# EAGLE design Multimeter1.2 (EAGLE 7.1.0)
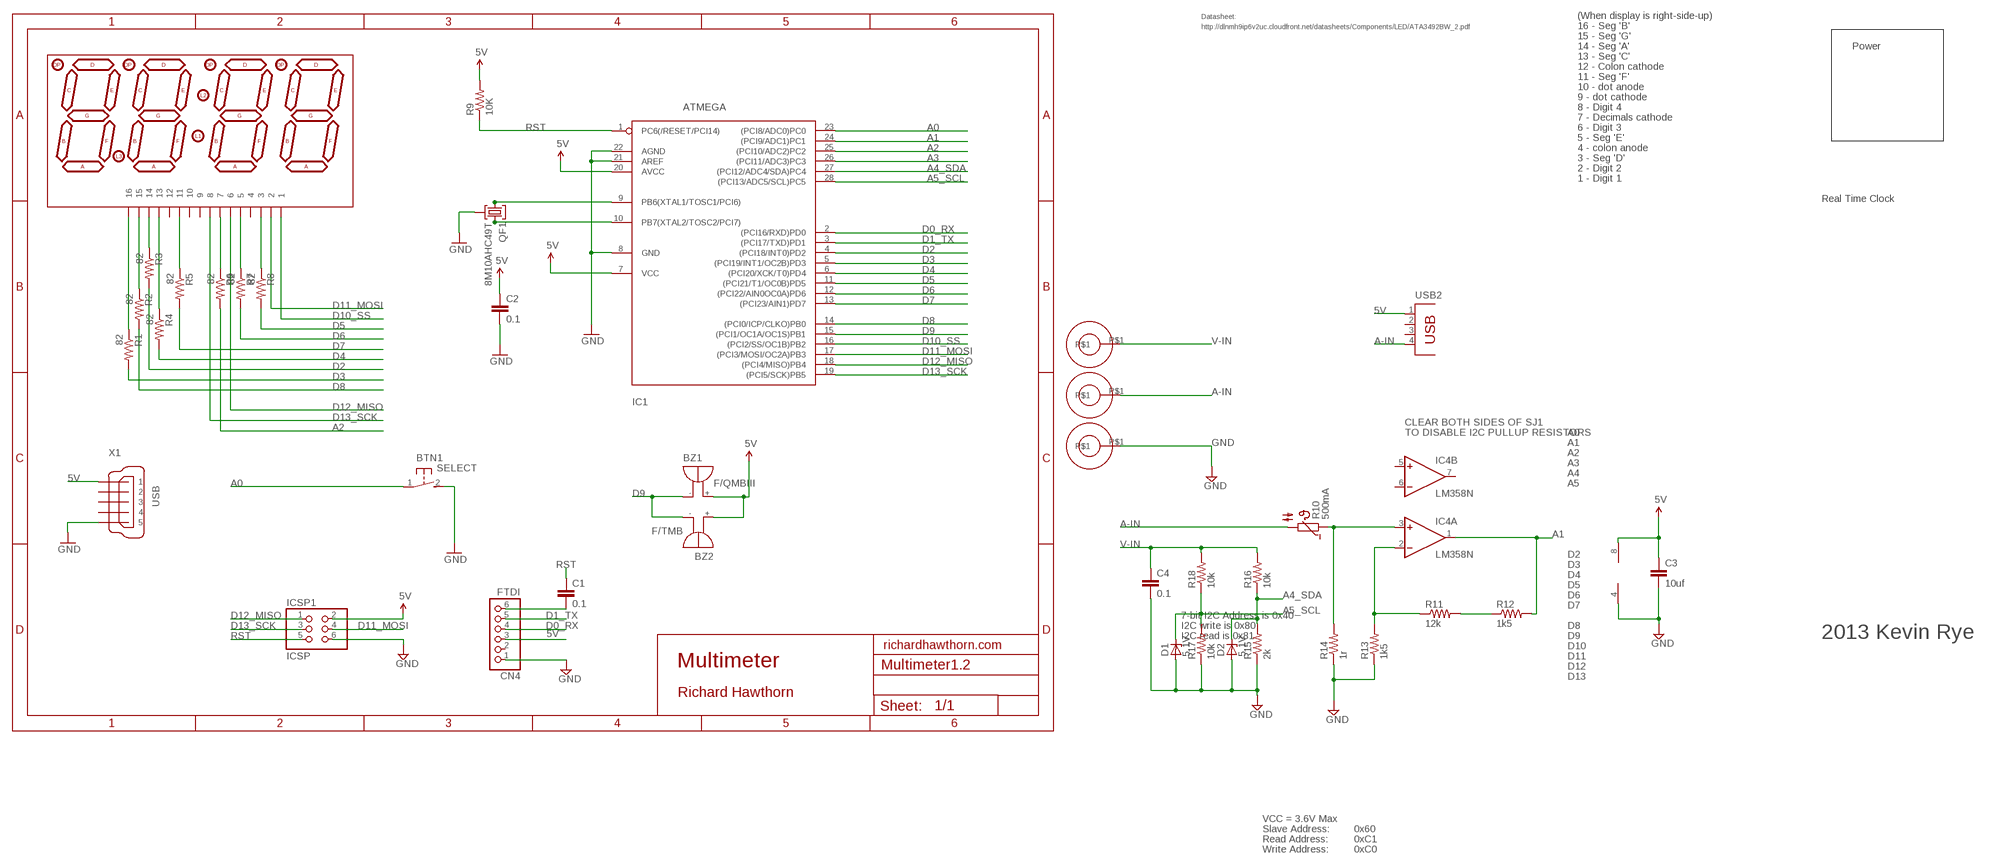
[diagram p0: schematic, sheet 1]

## Parts
BTN1  SELECT  DTS-3  [DTS-3]
BZ1  F/QMBIII  [F/QMBIII]
BZ2  F/TMB  [F/TMB]
C1  0.1  CAPPTH2  [CAP-PTH-SMALL2]
C2  0.1  CAPPTH2  [CAP-PTH-SMALL2]
C3  10uf  CAPPTH2  [CAP-PTH-SMALL2]
C4  0.1  CAPPTH2  [CAP-PTH-SMALL2]
CN4  FTDI  PINHD-1X6  [1X06]
D1  5.1V  BZX90  [DO34Z7]
D2  5.1V  BZX90  [DO34Z7]
IC1  ATMEGA  ATMEGA168PROUND  [DIL28-3-ROUND]
IC4  LM358N  [DIL08]
ICSP1  ICSP  PINHD-2X3  [2X03]
LED1  7SEG-4DIGIT  [SPARKFUN_7-SEGMENT-4DIGIT]
QF1  8M10AHC49T  [HC49U]
R1  82  R-US_0204/7  [0204/7]
R2  82  R-US_0204/7  [0204/7]
R3  82  R-US_0204/7  [0204/7]
R4  82  R-US_0204/7  [0204/7]
R5  82  R-US_0204/7  [0204/7]
R6  82  R-US_0204/7  [0204/7]
R7  82  R-US_0204/7  [0204/7]
R8  82  R-US_0204/7  [0204/7]
R9  10K  R-US_0204/7  [0204/7]
R10  500mA  B57164  [B57164]
R11  12k  R-US_0204/7  [0204/7]
R12  1k5  R-US_0204/7  [0204/7]
R13  1k5  R-US_0204/7  [0204/7]
R14  1r  R-US_0204/7  [0204/7]
R15  2k  R-US_0204/7  [0204/7]
R16  10k  R-US_0204/7  [0204/7]
R17  10k  R-US_0204/7  [0204/7]
R18  10k  R-US_0204/7  [0204/7]
U$1  BANANA  [BANANA]
U$5  BANANA  [BANANA]
U$6  BANANA  [BANANA]
USB2  PN87520  [PN87520]
X1  USB  MINI-USB_SHIELD5P2-32005-601  [32005-601]

## Nets
5V [power]: BZ1.+(-) BZ2.+ C2.1 C3.1 CN4.3 IC1.7(VCC) IC1.20(AVCC) IC4.8(P:V+) ICSP1.2 R9.2 USB2.1 X1.1
A0: BTN1.1 IC1.23((PCI8/ADC0)PC0)
A1: IC1.24((PCI9/ADC1)PC1) IC4.1(A:OUT) R12.2
A2: IC1.25((PCI10/ADC2)PC2) R6.2
A3: IC1.26((PCI11/ADC3)PC3)
A4_SDA: D2.C IC1.27((PCI12/ADC4/SDA)PC4) R15.2 R16.1
A5_SCL [power]: D1.C IC1.28((PCI13/ADC5/SCL)PC5) R17.2 R18.1
A-IN [power]: R10.2 U$5.P$1 USB2.4
D0_RX: CN4.4 IC1.2((PCI16/RXD)PD0)
D1_TX: CN4.5 IC1.3((PCI17/TXD)PD1)
D2: IC1.4((PCI18/INT0)PD2) R3.2
D3: IC1.5((PCI19/INT1/OC2B)PD3) R1.2
D4: IC1.6((PCI20/XCK/T0)PD4) R4.2
D5: IC1.11((PCI21/T1/OC0B)PD5) R8.2
D6: IC1.12((PCI22/AIN0OC0A)PD6) R7.2
D7: IC1.13((PCI23/AIN1)PD7) R5.2
D8: IC1.14((PCI0/ICP/CLKO)PB0) R2.2
D9: BZ1.-(+) BZ2.- IC1.15((PCI1/OC1A/OC1S)PB1)
D10_SS: IC1.16((PCI2/SS/OC1B)PB2) LED1.1
D11_MOSI: IC1.17((PCI3/MOSI/OC2A)PB3) ICSP1.4 LED1.2
D12_MISO: IC1.18((PCI4/MISO)PB4) ICSP1.1 LED1.6
D13_SCK: IC1.19((PCI5/SCK)PB5) ICSP1.3 LED1.8
GND [power]: BTN1.2 C2.2 C3.2 C4.2 CN4.1 D1.A D2.A IC1.8(GND) IC1.21(AREF) IC1.22(AGND) IC4.4(P:V-) ICSP1.6 QF1.2 R13.1 R14.1 R15.1 R17.1 U$6.P$1 X1.5
N$3: LED1.16 R1.1
N$4: IC4.2(A:-IN) R11.1 R13.2
N$5: LED1.15 R2.1
N$10: R11.2 R12.1
N$12: LED1.7 R6.1
N$13 [power]: IC4.3(A:+IN) R10.1 R14.2
N$16: IC1.9(PB6(XTAL1/TOSC1/PCI6)) QF1.1
N$20: C1.2 CN4.6
N$22: LED1.13 R4.1
N$24: LED1.14 R3.1
N$25: LED1.11 R5.1
N$26: IC1.10(PB7(XTAL2/TOSC2/PCI7)) QF1.3
N$29: LED1.5 R7.1
N$30: LED1.3 R8.1
RST: C1.1 IC1.1(PC6(/RESET/PCI14)) ICSP1.5 R9.1
V-IN [power]: C4.1 R16.2 R18.2 U$1.P$1
Unconnected: CN4.2 IC4.5(B:+IN) IC4.6(B:-IN) IC4.7(B:OUT) LED1.4 LED1.9 LED1.10 LED1.12 USB2.2 USB2.3 X1.2 X1.3 X1.4 X1.M1(S1) X1.M2(S2)

## Notes on the sheet
- Datasheet: | (When display is right-side-up)
- http://dlnmh9ip6v2uc.cloudfront.net/datasheets/Components/LED/ATA3492BW_2.pdf | 16 - Seg 'B'
- 15 - Seg 'G'
- 14 - Seg 'A' | Power
- 13 - Seg 'C'
- 12 - Colon cathode
- 11 - Seg 'F'
- 10 - dot anode
- 9 - dot cathode
- 8 - Digit 4
- 7 - Decimals cathode
- 6 - Digit 3
- 5 - Seg 'E'
- 4 - colon anode
- 3 - Seg 'D'
- 2 - Digit 2
- 1 - Digit 1
- Real Time Clock
- CLEAR BOTH SIDES OF SJ1
- TO DISABLE I2C PULLUP RESISTORS | A0
- A1
- A2
- A3
- A4
- A5
- D2
- D3
- D4
- D5
- D6
- D7
- 7-bit I2C Address is 0x40
- I2C write is 0x80 | D8
- I2C read is 0x81 | D9 | 2013 Kevin Rye
- richardhawthorn.com | D10
- D11
- Multimeter | D12
- D13
- Richard Hawthorn
- VCC = 3.6V Max
- Slave Address: | 0x60
- Read Address: | 0xC1
- Write Address: | 0xC0

## Library data of the parts
BTN1 = switch-tact:DTS-3
BZ1 = buzzer:F/QMBIII: BUZZER Source: Buerklin; OC_FARNELL: unknown; OC_NEWARK: unknown
BZ2 = buzzer:F/TMB: BUZZER Source: Buerklin; OC_FARNELL: unknown; OC_NEWARK: unknown
C1-C4 = LowPowerLab:CAP: Capacitor Standard 0603 ceramic capacitor, and 0.1" leaded capacitor.
CN4 = pinhead:PINHD-1X6: PIN HEADER
D1 D2 = diode:BZX90: Z DIODE
IC1 = adafruit:ATMEGA168*P: MICROCONTROLLER 16 kBytes FLASH 1 kBytes SRAM 512 Bytes EEPROM USART 8-channel 10 bit ADC
IC4 = linear:LM358: OP AMP also LM158; LM258; LM2904 Source: http://cache.national.com/ds/LM/LM158.pdf
ICSP1 = pinhead:PINHD-2X3: PIN HEADER
LED1 = sparkfun-4digit-sseg:7SEG-4DIGIT
QF1 = crystal:8M10AHC49T: Monolithic Crystal Filters Source: www.vanlong.com; OC_FARNELL: unknown; OC_NEWARK: unknown
R1-R9 R11-R18 = adafruit:R-US_: RESISTOR, American symbol
R10 = ptc-ntc:B57164: SIEMENS NTC; MPN: B57164K474K52; OC_FARNELL: 9753451; OC_NEWARK: 29M3118
U$1 U$5 U$6 = Richards:BANANA
USB2 = con-berg:PN87520: BERG USB connector; OC_FARNELL: unknown; OC_NEWARK: unknown
X1 = con-cypressindustries:MINI-USB_SHIELD5P2-: MINI USB-B R/A DIP 5pol. Source: www.cypressindustries.com; OC_FARNELL: unknown; OC_NEWARK: unknown

## Net classes
1 power: width 0.635 mm, clearance 0.254 mm

## Board
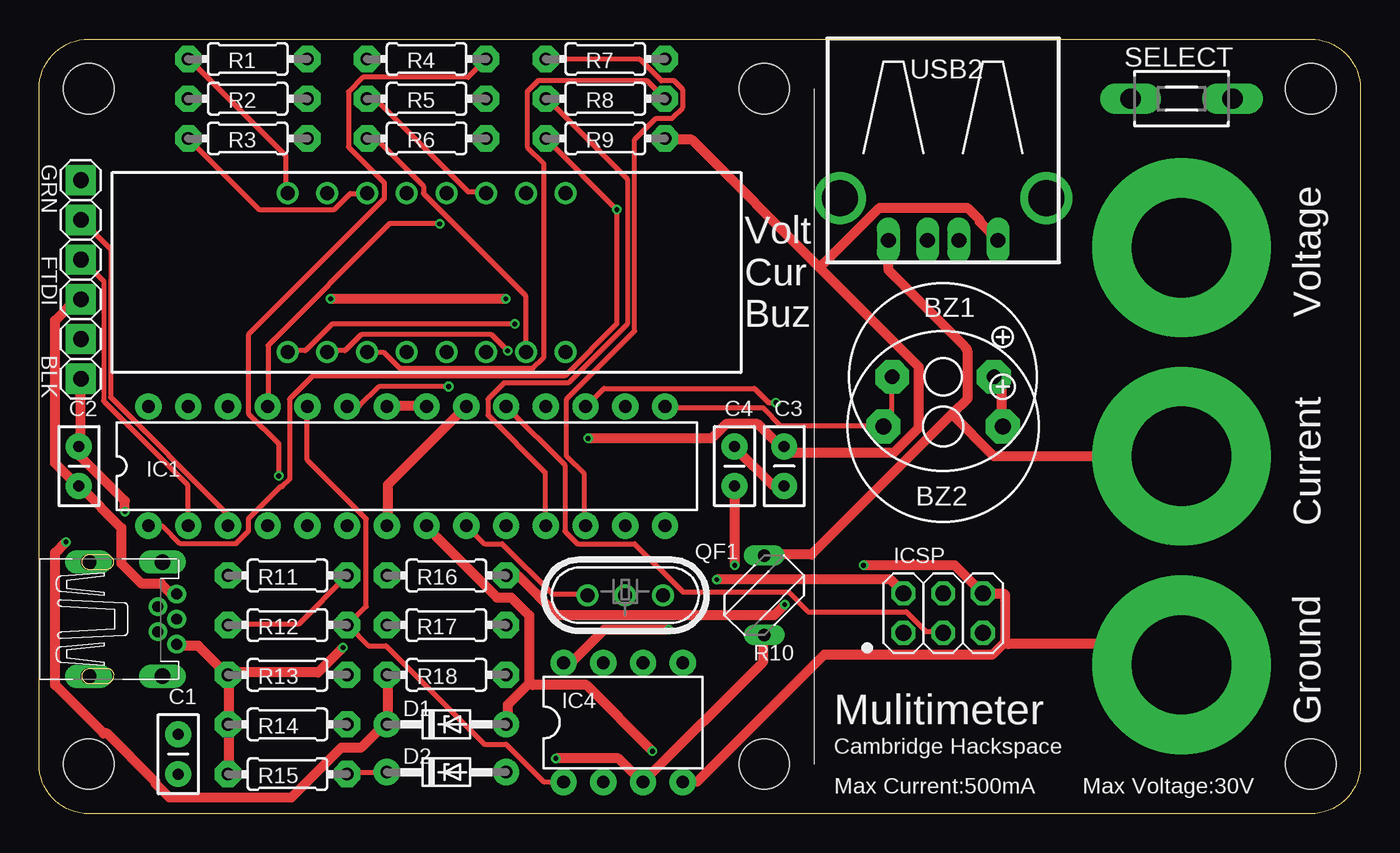
[diagram p1: board, top side]
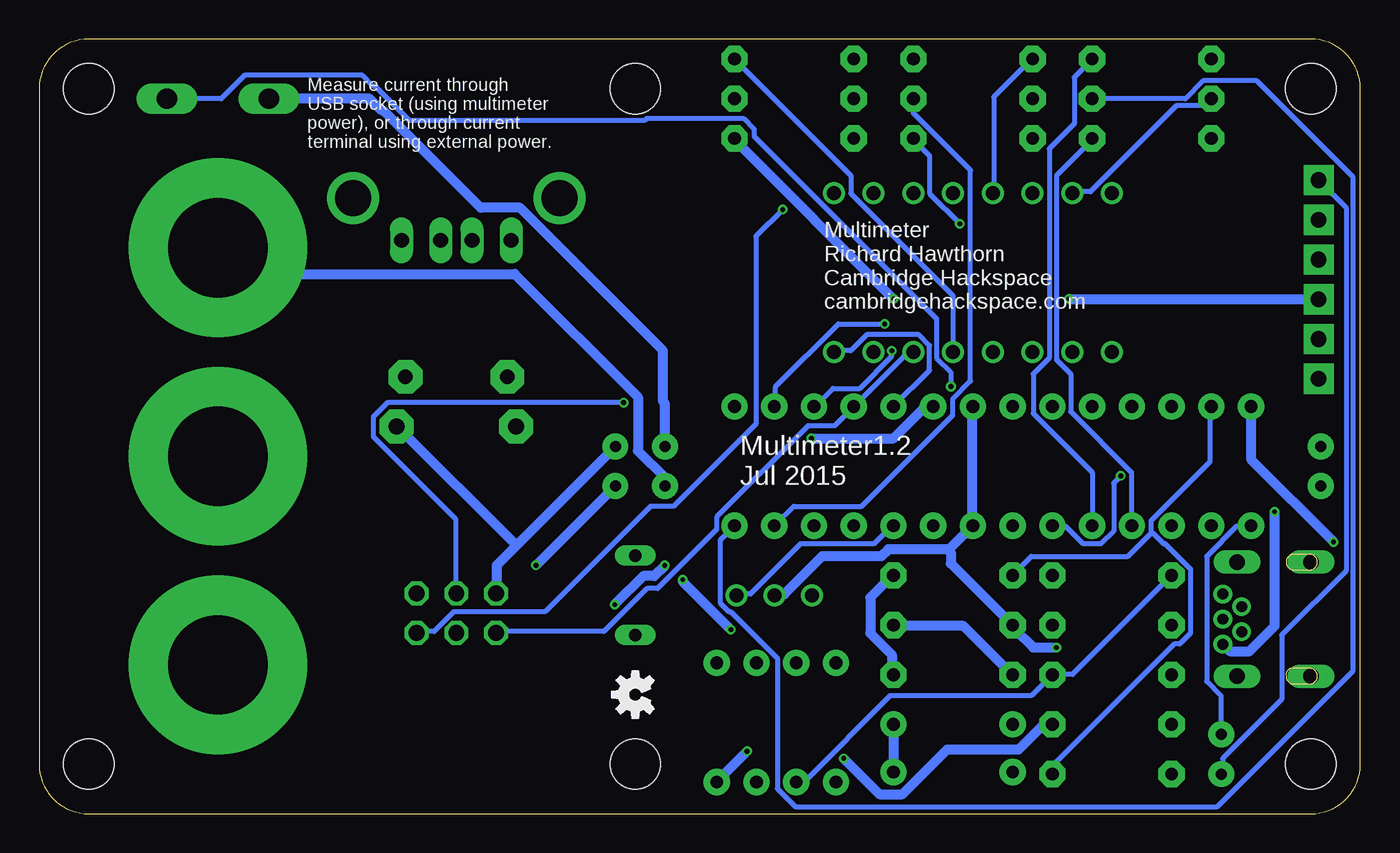
[diagram p2: board, bottom side, seen from below]

Size 84.45 x 49.53 mm. Coordinates in mm from the lower left corner, seen from the top.
Outline: 46.35,49.53 3.17,49.53 arc90 0,46.35 0,3.17 arc90 3.17,0 46.35,0
Outline: 34.29,49.53 81.28,49.53 arc-90 84.45,46.35 84.45,3.17 arc-90 81.28,0 27.94,0
Copper layers (1*16): Top 0.035mm / dielectric 1.5mm / Bottom 0.035mm
Design rules "ITEADstudio_DRC *": minimum track width 12mil, minimum drill 12mil, track to track 6mil, track to pad 6mil, pad to pad 6mil, via to via 6mil, smd to smd 0mil, copper to edge 10mil, drill to drill 10mil, minimum pad ring 10mil, minimum via ring 6mil, stop-mask expansion 2mil, vias tented up to drill 100mil, thermal gap 15mil
Holes 3.2 mm at 3.17,3.17 46.35,3.17 3.17,46.35 46.35,46.35 81.28,46.35 81.28,3.17
tKeepout: area 0,0 to 5.7,5.7; area 0,43.8 to 5.7,49.5; area 78.7,43.8 to 84.5,49.5; area 78.7,0 to 84.5,5.7
bKeepout: area 0,43.8 to 5.7,49.5; area 0,0 to 5.7,5.7; area 78.7,43.8 to 84.5,49.5; area 78.7,0 to 84.5,5.7
tRestrict: area 24.3,8.9 to 29.1,12.8; area 5.8,16.9 to 6.9,18.5; area 5.2,9.7 to 6.7,10.4
bRestrict: area 27.4,17.7 to 29.2,18.7; area 21.1,13.8 to 22.9,14.9; area 21.6,12.6 to 22.1,13.2; area 20.7,12.6 to 21.2,13.2; area 20.2,12.8 to 20.7,13.5; area 20.1,13.4 to 20.6,14; area 26.5,18.9 to 27.1,19.5; area 26.5,17.9 to 27.1,18.5; area 27.5,19.1 to 28,19.8; area 27.9,18.8 to 29.1,19.6

### Footprints (pad centres in the part's own frame; a part is rotated, then mirrored left to right if it is on the bottom)
DTS-3 = drill 1.3 long: 1 -3.25,0; 2 3.25,0
F/QMBIII = drill 0.914 pad 2.159 octagon: + 3.251,0; - -3.251,0
F/TMB = drill 1.016 pad 2.159 octagon: + 3.81,0; - -3.81,0
CAP-PTH-SMALL2 = drill 0.7 pad 1.651: 1 0,0; 2 2.54,0
1X06 = drill 1 pad 1.93 square: 1 -6.35,0; 2 -3.81,0; 3 -1.27,0; 4 1.27,0; 5 3.81,0; 6 6.35,0
DO34Z7 = drill 0.813 pad 1.676: A 3.81,0; C -3.81,0
DIL28-3-ROUND = drill 0.813 pad 1.676: 1 -16.51,-3.81; 2 -13.97,-3.81; 3 -11.43,-3.81; 4 -8.89,-3.81; 5 -6.35,-3.81; 6 -3.81,-3.81; 7 -1.27,-3.81; 8 1.27,-3.81; 9 3.81,-3.81; 10 6.35,-3.81; 11 8.89,-3.81; 12 11.43,-3.81; 13 13.97,-3.81; 14 16.51,-3.81; 15 16.51,3.81; 16 13.97,3.81; 17 11.43,3.81; 18 8.89,3.81; 19 6.35,3.81; 20 3.81,3.81; 21 1.27,3.81; 22 -1.27,3.81; 23 -3.81,3.81; 24 -6.35,3.81; 25 -8.89,3.81; 26 -11.43,3.81; 27 -13.97,3.81; 28 -16.51,3.81
DIL08 = drill 0.813 pad 1.676: 1 -3.81,-3.81; 2 -1.27,-3.81; 3 1.27,-3.81; 4 3.81,-3.81; 5 3.81,3.81; 6 1.27,3.81; 7 -1.27,3.81; 8 -3.81,3.81
2X03 = drill 1.016 octagon: 1 -2.54,-1.27; 2 -2.54,1.27; 3 0,-1.27; 4 0,1.27; 5 2.54,-1.27; 6 2.54,1.27
SPARKFUN_7-SEGMENT-4DIGIT = drill 0.9: 1 -8.89,-5.08; 2 -6.35,-5.08; 3 -3.81,-5.08; 4 -1.27,-5.08; 5 1.27,-5.08; 6 3.81,-5.08; 7 6.35,-5.08; 8 8.89,-5.08; 9 8.89,5.08; 10 6.35,5.08; 11 3.81,5.08; 12 1.27,5.08; 13 -1.27,5.08; 14 -3.81,5.08; 15 -6.35,5.08; 16 -8.89,5.08
HC49U = drill 0.9: 1 -2.413,0; 2 -0.027,0; 3 2.413,0
0204/7 = drill 0.813 pad 1.676 octagon: 1 -3.81,0; 2 3.81,0
B57164 = drill 0.813 long: 1 -2.54,0; 2 2.54,0
BANANA = drill 6.35 pad 11.43: P$1 0,0
PN87520 = drill 0.95 long: 1 -3.5,2.71; 2 -1,2.71; 3 1,2.71; 4 3.5,2.71 | drill 2.3: P$1 -6.604,0; P$2 6.604,0
32005-601 = drill 0.7 pad 1.016: 1 2.825,1.6; 2 1.625,0.8; 3 2.825,0; 4 1.625,-0.8; 5 2.825,-1.6 | drill 1 pad 1.422 long: M1 -2.825,3.65; M2 -2.825,-3.65; M3 1.925,3.65; M4 1.925,-3.65

### Placement (x,y rotation side)
BTN1  73.03,45.72 180 top
BZ1  57.78,27.94 0 top
BZ2  57.78,24.77 0 top
C1  8.89,5.08 270 top
C2  2.54,20.95 90 top
C3  47.62,23.5 270 top
C4  44.45,20.95 90 top
CN4  2.67,34.16 90 top
D1  26.04,5.71 0 top
D2  26.04,2.67 0 top
IC1  23.5,22.23 0 top
IC4  37.34,5.84 0 top
ICSP1  57.78,12.83 0 top
LED1  24.77,34.61 0 top
QF1  37.47,13.97 0 top
R1  13.34,48.26 0 top
R2  13.34,45.72 0 top
R3  13.34,43.18 0 top
R4  24.77,48.26 0 top
R5  24.77,45.72 0 top
R6  24.77,43.18 0 top
R7  36.2,48.26 180 top
R8  36.2,45.72 180 top
R9  36.2,43.18 0 top
R10  46.35,13.97 90 top
R11  15.88,15.24 0 top
R12  15.88,12.06 0 top
R13  15.88,8.89 0 top
R14  15.88,5.71 0 top
R15  15.88,2.54 0 top
R16  26.04,15.24 0 top
R17  26.04,12.06 0 top
R18  26.04,8.89 0 top
U$1  73.03,36.2 0 top
U$3  [OSHW-LOGO-S]  46.35,7.62 90 bottom
U$5  73.03,22.86 0 top
U$6  73.03,9.53 0 top
USB2  57.78,39.37 180 top
X1  5.97,12.45 0 top

### Tracks (layer width: path | path; a pad name or v marks a point on that pad's centre or on a via)
5V  (via drill 0.3)
  Top 0.635: X1.1 8.69,14.06 8.46,14.06 7.77,14.74 6.51,14.74 5.26,16 5.26,18.29 2.63,20.92 C2.1 2.29,21.14 1.03,22.4 1.03,31.55 2.29,32.8 2.63,32.8 CN4.3 | IC1.7 22.29,18.52 22.29,21.03 27.2,25.95 IC1.20 | BZ2.+ 61.49,24.8 61.49,27.43 61.04,27.89 BZ1.+ | v40.23,11.77 36.12,11.77 34.06,9.72 33.6,9.72 IC4.8 | v43.32,14.97 54.41,14.97 55.21,14.17 ICSP1.2 | 49.89,34.92 56.24,28.57 56.24,24.69 54.63,23.09 48.01,23.09 47.66,23.43 C3.1 47.32,23.55 45.95,24.92 43.89,24.92 42.98,24 v35.09,24 | 49.89,34.92 41.72,43.09 40.01,43.09 R9.2 | v29.83,32.92 v18.63,32.92 | 49.89,34.92 53.72,38.75 59.32,38.75 60.12,37.95 60.12,37.83 61.27,36.69 USB2.1
  Bottom 0.635: 53.95,17.14 47.66,23.43 C3.1 | 53.95,17.14 55.21,15.89 55.21,14.17 ICSP1.2 | v40.23,11.77 43.32,14.86 v43.32,14.97 | 53.95,17.14 61.49,24.69 BZ2.+ | v35.09,24 29.83,24 27.89,25.95 27.32,25.95 IC1.20 | v18.63,32.92 2.74,32.92 CN4.3 | v29.83,32.92 40.01,43.09 R9.2
A0  (via drill 0.3)
  Top 0.305: v26.18,27.32 21.72,27.32 20.46,26.06 19.77,26.06 IC1.23
  Bottom 0.305: v26.18,27.32 26.18,28.23 27.09,29.15 27.09,31.66 38.75,43.32 38.75,43.78 39.43,44.46 45.61,44.46 45.72,44.35 60.81,44.35 62.98,46.52 63.09,46.52 63.78,47.21 71.32,47.21 72.81,45.72 BTN1.1 76.24,45.15
A1
  Top 0.305: IC4.1 33.49,2.06 32.23,2.06 29.83,4.46 28.46,4.46 22.17,10.74 21.03,10.74 19.77,12 R12.2 19.77,12.12 20.92,13.26 20.92,18.86 17.14,22.63 IC1.24
A2  (via drill 0.3)
  Top 0.305: v25.6,37.72 22.4,37.72 14.63,29.95 14.63,26.06 IC1.25
  Bottom 0.305: v25.6,37.72 27.55,39.66 27.55,42.06 28.57,43.09 R6.2
A4_SDA
  Top 0.305: R15.2 19.77,2.63 22.17,2.63 D2.C
  Bottom 0.305: 13.37,17.95 13.37,18.75 9.6,22.52 9.6,25.95 IC1.27 | 13.37,17.95 14.86,16.46 21.03,16.46 22.17,15.32 R16.1 | R15.2 19.66,2.63 19.66,3.09 11.89,10.86 11.54,10.86 10.86,11.54 10.86,15.66 12.46,17.26 12.57,17.26 13.26,17.95 13.37,17.95
A5_SCL  (via drill 0.3)
  Top 0.635: R18.1 22.29,8.8 22.29,5.71 D1.C 21.95,5.6 20.57,4.23 19.32,4.23 16.12,1.03 8.34,1.03 7.43,1.94 7.43,2.06 4.34,5.14 4.12,5.14 1.03,8.23 1.03,16.69 v1.71,17.37
  Bottom 0.635: v1.71,17.37 6.97,22.63 6.97,25.95 IC1.28 | R17.2 29.83,12 25.38,12 22.29,8.91 R18.1
A-IN
  Top 0.635: 58.35,25.55 59.32,26.52 59.32,29.6 59.21,29.83 54.29,34.75 54.29,36.58 USB2.4 | 58.35,25.55 49.38,16.57 46.41,16.57 R10.2 | 58.35,25.55 61.04,22.86 U$5.P$1
D0_RX
  Top 0.305: IC1.2 9.49,18.52 9.49,21.03 4.12,26.4 4.12,34.06 2.74,35.43 CN4.4
D1_TX
  Top 0.305: IC1.3 12,18.52 12,19.2 4.57,26.63 4.57,36.12 2.74,37.95 CN4.5
D2
  Bottom 0.305: IC1.4 14.63,18.52 14.63,21.83 18.52,25.72 18.52,28.12 19.43,29.03 19.43,40.8 17.14,43.09 R3.2
D3
  Bottom 0.305: IC1.5 17.14,21.83 20.92,25.6 20.92,28.12 19.89,29.15 19.89,42.52 18.29,44.12 18.29,47.09 17.14,48.23 R1.2
D4  (via drill 0.3)
  Top 0.305: v15.32,21.6 15.32,23.66 13.37,25.6 13.37,30.63 22.06,39.32 22.06,40.35 19.77,42.63 19.77,46.18 20.69,47.09 27.43,47.09 28.57,48.23 R4.2
  Bottom 0.305: v15.32,21.6 15.77,21.14 15.77,18.06 16.57,17.26 17.72,17.26 18.86,18.4 19.66,18.4 IC1.6
D5
  Top 0.305: IC1.11 32.35,18.52 32.35,21.83 28.69,25.49 28.69,26.52 29.72,27.55 33.83,27.55 37.6,31.32 37.6,40.58 32.46,45.72 R8.2
D6
  Top 0.305: R7.2 32.46,48.23 38.41,48.23 39.78,46.86 40.58,46.86 41.15,46.29 41.15,45.15 40.46,44.46 39.43,44.46 38.06,43.09 38.06,30.86 33.72,26.52 33.72,22.86 34.86,21.72 34.86,18.52 IC1.12
D7
  Bottom 0.305: R5.2 28.57,44.81 24.92,41.15 24.92,27.66 26.06,26.52 26.06,25.49 31.89,19.66 36.23,19.66 37.38,18.52 IC1.13
D8
  Bottom 0.305: R2.2 11.2,45.72 10.06,46.86 6.63,46.86 0.46,40.69 0.46,9.14 9.14,0.46 36.12,0.46 37.26,1.6 37.26,9.94 40.23,12.92 40.35,12.92 40.92,13.49 40.92,17.49 40.01,18.4 IC1.14
D9
  Top 0.305: IC1.15 40.01,25.95 46.29,25.95 47.43,24.8 53.95,24.8 BZ2.- 53.95,24.92 54.52,25.49 54.52,27.89 BZ1.-
D10_SS  (via drill 0.3)
  Top 0.305: v30.4,31.32 18.75,31.32 17.03,29.6 15.89,29.6 LED1.1
  Bottom 0.305: v30.4,31.32 33.38,31.32 37.38,27.32 37.38,26.06 IC1.16
D11_MOSI  (via drill 0.3)
  Top 0.305: v29.95,29.6 28.92,30.63 20.57,30.63 19.55,29.6 18.52,29.6 LED1.2 | v47.09,26.29 46.63,26.29 45.72,27.2 36.12,27.2 34.98,26.06 IC1.17
  Bottom 0.305: v29.95,29.6 29.95,29.26 32,27.2 33.72,27.2 34.86,26.06 IC1.17 | v47.09,26.29 62.18,26.29 63.09,25.38 63.09,24.12 57.84,18.86 57.84,14.17 ICSP1.4
D12_MISO
  Bottom 0.305: LED1.6 28.57,29.49 28.92,29.49 32.35,26.06 IC1.18 32.46,25.95 33.6,24.8 35.32,24.8 41.15,18.97 41.15,18.17 44.92,14.4 45.61,14.4 48.35,11.66 55.21,11.66 ICSP1.1
D13_SCK
  Top 0.305: ICSP1.3 57.72,11.66 56.69,11.66 55.44,12.92 49.15,12.92 47.89,14.17 41.15,14.17 38.06,17.26 34.4,17.26 33.6,18.06 33.6,22.29 29.95,25.95 IC1.19
  Bottom 0.305: LED1.8 33.6,29.6 32.58,29.6 31.55,30.63 28.23,30.63 27.55,29.95 27.55,28.35 29.83,26.06 IC1.19
GND  (via drill 0.3)
  Top 0.635: CN4.1 2.63,27.77 2.63,23.55 C2.2 2.63,23.2 2.63,22.86 5.49,20 v5.49,19.32 | R15.1 12.12,2.63 12.12,5.71 R14.1 12.12,5.94 12.12,8.57 R13.1 | X1.5 8.8,10.74 10.17,10.74 12,8.91 R13.1 | IC1.22 22.29,26.06 24.69,26.06 IC1.21 | 31.32,8.34 29.95,6.97 29.95,5.71 D1.A | 31.32,8.34 31.32,12.69 30.18,13.83 29.26,13.83 24.69,18.4 IC1.8 | v19.43,10.63 17.83,9.03 12.34,9.03 R13.1 | C3.2 47.55,21.03 46.86,21.03 44.46,23.43 C4.2 | 61.72,10.97 60.92,10.17 50.18,10.17 42.06,2.06 41.15,2.06 IC4.4 | 61.72,10.97 61.72,14.06 60.35,14.06 ICSP1.6 60.12,14.29 58.52,15.89 v52.69,15.89 | v39.2,4 34.98,8.23 31.55,8.23 31.32,8.34 | 61.72,10.97 61.95,10.86 71.67,10.86 72.92,9.6 U$6.P$1
  Bottom 0.635: v5.49,19.32 5.49,12 7.09,10.4 8.34,10.4 8.69,10.74 X1.5 | D2.A 29.83,2.74 D1.A | 26.29,16.92 30.18,16.92 30.63,16.46 34.4,16.46 36.8,14.06 37.38,14.06 QF1.2 | 26.29,16.92 24.8,18.4 IC1.8 24.8,18.63 24.8,25.95 IC1.21 | 26.29,16.92 26.18,16.69 26.18,16 22.29,12.12 R17.1 22.06,11.77 20.92,10.63 v19.43,10.63 | C4.2 44.46,23.55 44.46,26.18 44.58,26.4 44.58,29.6 53.72,38.75 56.24,38.75 62.41,44.92 62.64,45.03 63.32,45.72 BTN1.2 | v52.69,15.89 C3.2 | v39.2,4 41.15,2.06 IC4.4
N$3
  Top 0.305: LED1.16 15.77,39.78 15.77,42.06 9.6,48.23 R1.1
N$4
  Bottom 0.305: R11.1 12.12,15.2 18.4,8.91 19.66,8.91 R13.2 21.03,7.54 30.06,7.54 35.55,2.06 36.01,2.06 IC4.2
N$5
  Bottom 0.305: LED1.15 18.4,39.78 17.26,39.78 11.77,45.26 10.06,45.26 9.6,45.72 R2.1
N$10
  Top 0.305: R12.1 12.12,12.12 16.57,12.12 19.66,15.2 R11.2
N$12
  Top 0.305: LED1.7 31.09,29.6 31.09,33.15 24.57,39.66 24.57,40.12 21.6,43.09 21.03,43.09 R6.1
N$13  (via drill 0.3)
  Top 0.635: R10.1 46.29,11.43 46.29,9.72 IC4.3 38.41,2.17 37.03,3.54 v33.03,3.54
  Bottom 0.635: R14.2 20.23,5.71 21.83,4.12 26.4,4.12 29.26,1.26 30.75,1.26 v33.03,3.54
N$16
  Top 0.305: IC1.9 28.46,17.26 29.6,17.26 32.8,14.06 34.98,14.06 QF1.1
N$20
  Bottom 0.305: C1.2 8.8,2.63 8.8,3.54 5.03,7.32 5.03,11.43 0.91,15.54 0.91,38.75 2.63,40.46 CN4.6
N$22
  Bottom 0.305: LED1.13 23.43,39.78 23.43,45.83 21.03,48.23 R4.1
N$24
  Top 0.305: LED1.14 20.92,39.66 19.89,39.66 18.86,38.63 14.06,38.63 9.6,43.09 R3.1
N$25
  Top 0.305: R5.1 21.49,45.72 27.43,39.78 28.57,39.78 LED1.11
N$26
  Bottom 0.305: QF1.3 39.78,14.06 38.98,14.06 35.78,17.26 31.09,17.26 29.95,18.4 IC1.10
N$29
  Bottom 0.305: LED1.5 26.06,29.6 26.06,33.15 32.58,39.66 32.58,40.8 40.01,48.23 R7.1
N$30
  Top 0.305: R8.1 38.86,46.86 31.89,46.86 31.2,46.18 31.2,42.63 32.23,41.6 32.23,29.15 31.55,28.46 23.09,28.46 22.06,29.49 21.03,29.49 LED1.3
RST  (via drill 0.3)
  Top 0.305: R9.1 32.46,43.09 v36.92,38.63 36.92,31.32 33.6,28 17.49,28 16,26.52 16,21.37 15.54,20.92 15.43,20.92 13.37,18.86 13.37,18.06 12.57,17.26 9.03,17.26 7.89,18.4 7.09,18.4 IC1.1
  Bottom 0.305: C1.1 8.91,5.14 8.91,7.54 9.83,8.46 9.83,16.46 7.89,18.4 7.09,18.4 IC1.1 | v36.92,38.63 38.63,36.92 38.63,24.92 43.89,19.66 45.38,19.66 52.12,12.92 57.95,12.92 59.21,11.66 60.24,11.66 ICSP1.5
V-IN  (via drill 0.3)
  Top 0.635: v47.66,13.37 46.98,12.69 33.15,12.69 30.63,15.2 29.95,15.2 R16.2 | v44.46,15.89 44.46,20.92 C4.1
  Bottom 0.635: R18.2 29.95,8.91 29.95,10.17 31.32,11.54 31.32,13.83 29.95,15.2 R16.2 | C4.1 44.46,21.03 44.46,21.49 46.18,23.2 46.18,26.63 54.06,34.52 71.32,34.52 72.92,36.12 U$1.P$1 | v47.66,13.37 45.83,15.2 45.15,15.2 v44.46,15.89

### Text on the board
tNames: GRN | FTDI | Voltage | Volt / Cur / Buz | BLK | Current | Mulitimeter | Ground | Cambridge Hackspace | Max Current:500mA | Max Voltage:30V
bNames: Measure current through / USB socket (using multimeter / power), or through current / terminal using external power. | Multimeter / Richard Hawthorn / Cambridge Hackspace / cambridgehackspace.com | Multimeter1.2 / Jul 2015
tDocu: REG